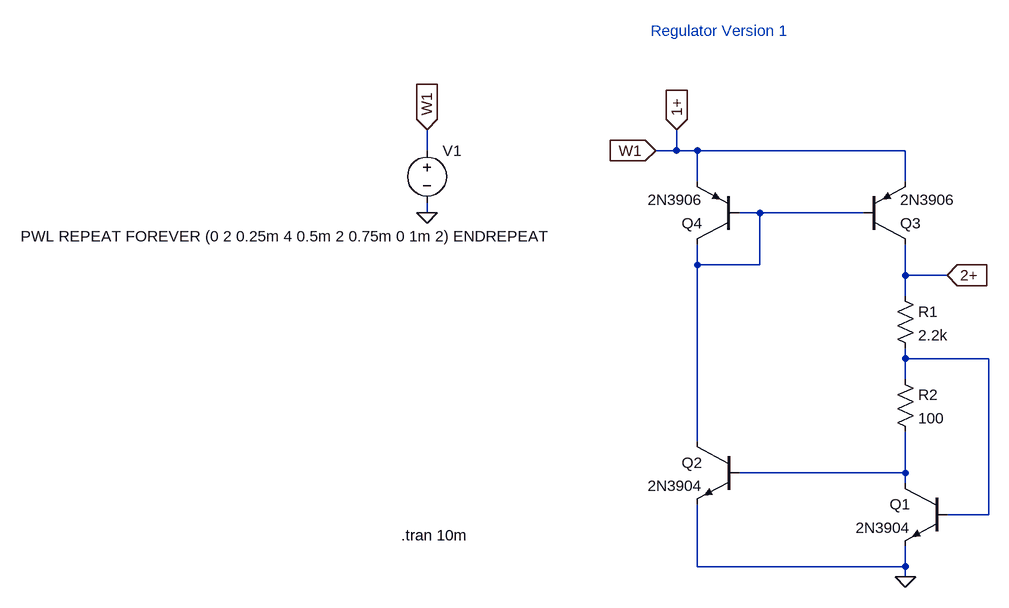
[diagram p0: schematic regulator_v1_ltspice.asc]
regulator_v1_ltspice.asc, the LTspice schematic file:
Version 4
SHEET 1 880 680
WIRE -480 -368 -480 -400
WIRE -96 -368 -96 -400
WIRE -96 -368 -128 -368
WIRE -64 -368 -96 -368
WIRE 256 -368 -64 -368
WIRE -64 -320 -64 -368
WIRE 256 -320 256 -368
WIRE -480 -272 -480 -288
WIRE 32 -272 0 -272
WIRE 192 -272 32 -272
WIRE -64 -192 -64 -224
WIRE 32 -192 32 -272
WIRE 32 -192 -64 -192
WIRE 256 -176 256 -224
WIRE 320 -176 256 -176
WIRE 256 -144 256 -176
WIRE 256 -48 256 -64
WIRE 384 -48 256 -48
WIRE 256 -16 256 -48
WIRE -64 80 -64 -192
WIRE 256 128 256 64
WIRE 256 128 0 128
WIRE 256 144 256 128
WIRE 384 192 384 -48
WIRE 384 192 320 192
WIRE -64 272 -64 176
WIRE 256 272 256 240
WIRE 256 272 -64 272
WIRE 256 288 256 272
FLAG 256 288 0
FLAG -128 -368 W1
IOPIN -128 -368 In
FLAG -96 -400 1+
IOPIN -96 -400 In
FLAG 320 -176 2+
IOPIN 320 -176 In
FLAG -480 -272 0
FLAG -480 -400 W1
IOPIN -480 -400 In
SYMBOL npn 320 144 M0
SYMATTR InstName Q1
SYMATTR Value 2N3904
SYMBOL npn 0 80 M0
SYMATTR InstName Q2
SYMATTR Value 2N3904
SYMBOL pnp 192 -224 M180
SYMATTR InstName Q3
SYMATTR Value 2N3906
SYMBOL pnp 0 -224 R180
SYMATTR InstName Q4
SYMATTR Value 2N3906
SYMBOL res 240 -160 R0
SYMATTR InstName R1
SYMATTR Value 2.2k
SYMBOL res 240 -32 R0
SYMATTR InstName R2
SYMATTR Value 100
SYMBOL voltage -480 -384 R0
WINDOW 3 -625 148 Left 2
WINDOW 123 0 0 Left 0
WINDOW 39 0 0 Left 0
SYMATTR InstName V1
SYMATTR Value PWL REPEAT FOREVER (0 2 0.25m 4 0.5m 2 0.75m 0 1m 2) ENDREPEAT
TEXT -520 224 Left 2 !.tran 10m
TEXT -136 -552 Left 2 ;Regulator Version 1

The netlist it stands for:
* regulator_v1_ltspice.asc
Q1 N003 N002 0 0 2N3904
Q2 N001 N003 0 0 2N3904
Q3 2+ N001 1+ 0 2N3906
Q4 N001 N001 1+ 0 2N3906
R1 2+ N002 2.2k
R2 N002 N003 100
V1 1+ 0 PWL REPEAT FOREVER (0 2 0.25m 4 0.5m 2 0.75m 0 1m 2) ENDREPEAT
.model NPN NPN
.model PNP PNP
.lib standard.bjt
.tran 10m
* Regulator Version 1
.backanno
.end